# Altium project JTAG_Adapter.PrjPCB
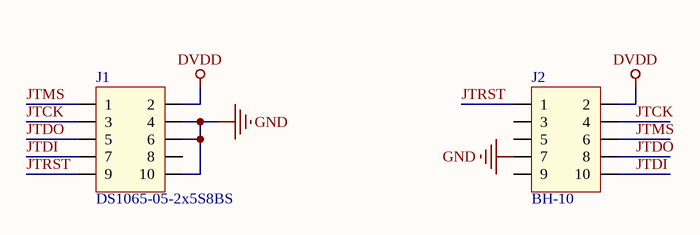
[diagram p0: main.SchDoc]
1 sheet, 2 parts. Net scope: global (net labels, ports and power ports of the same name join across sheets).
Board file: JTAG_Adapter.PcbDoc

## Sheet main.SchDoc: ARM Cortex-Debug to ST-Link JTAG
size A4; ApprovedBy: N/A; CheckedBy: N/A; Author: BPS; CompanyName: N/A; DrawnBy: BPS; Engineer: BPS; Organization: N/A; Address1: N/A; Address2: N/A; Address3: N/A; Address4: N/A; DocumentNumber: SSP-01; Revision: A; SheetNumber: 1; SheetTotal: 1; Application_BuildNumber: 1

### Parts
J1  DS1065-05-2x5S8BS  [DS1065-05-2x5S8BS]
J2  BH-10  [IDC-10-2.54]

### Nets
DVDD: J1.2 J2.2
GND: J1.4 J1.6 J1.10 J2.7
JTCK: J1.3 J2.4
JTDI: J1.7 J2.10
JTDO: J1.5 J2.8
JTMS: J1.1 J2.6
JTRST: J1.9 J2.1

Not connected (* = marked no-connect by the designer): J1 8; J2 3 5 9

### Notes on the sheet
- Title
- Size:
- Date:
- A4
- Number:
- Time:
- Revision:
- Sheet
- of
- File:

### Library data of the parts
J1 = DS1065-05-2x5S8BS: System: Connector